# EasyEDA schematic SCH_M5 Stick DCC Interface_2022-09-24.json
TITLE: DCC Interface; REV: 5.0; Date: 2020-03-20; Sheet: 1/1; Drawn By: Hans R. Tanner; Company: IoTT - Internet of Toy Trains
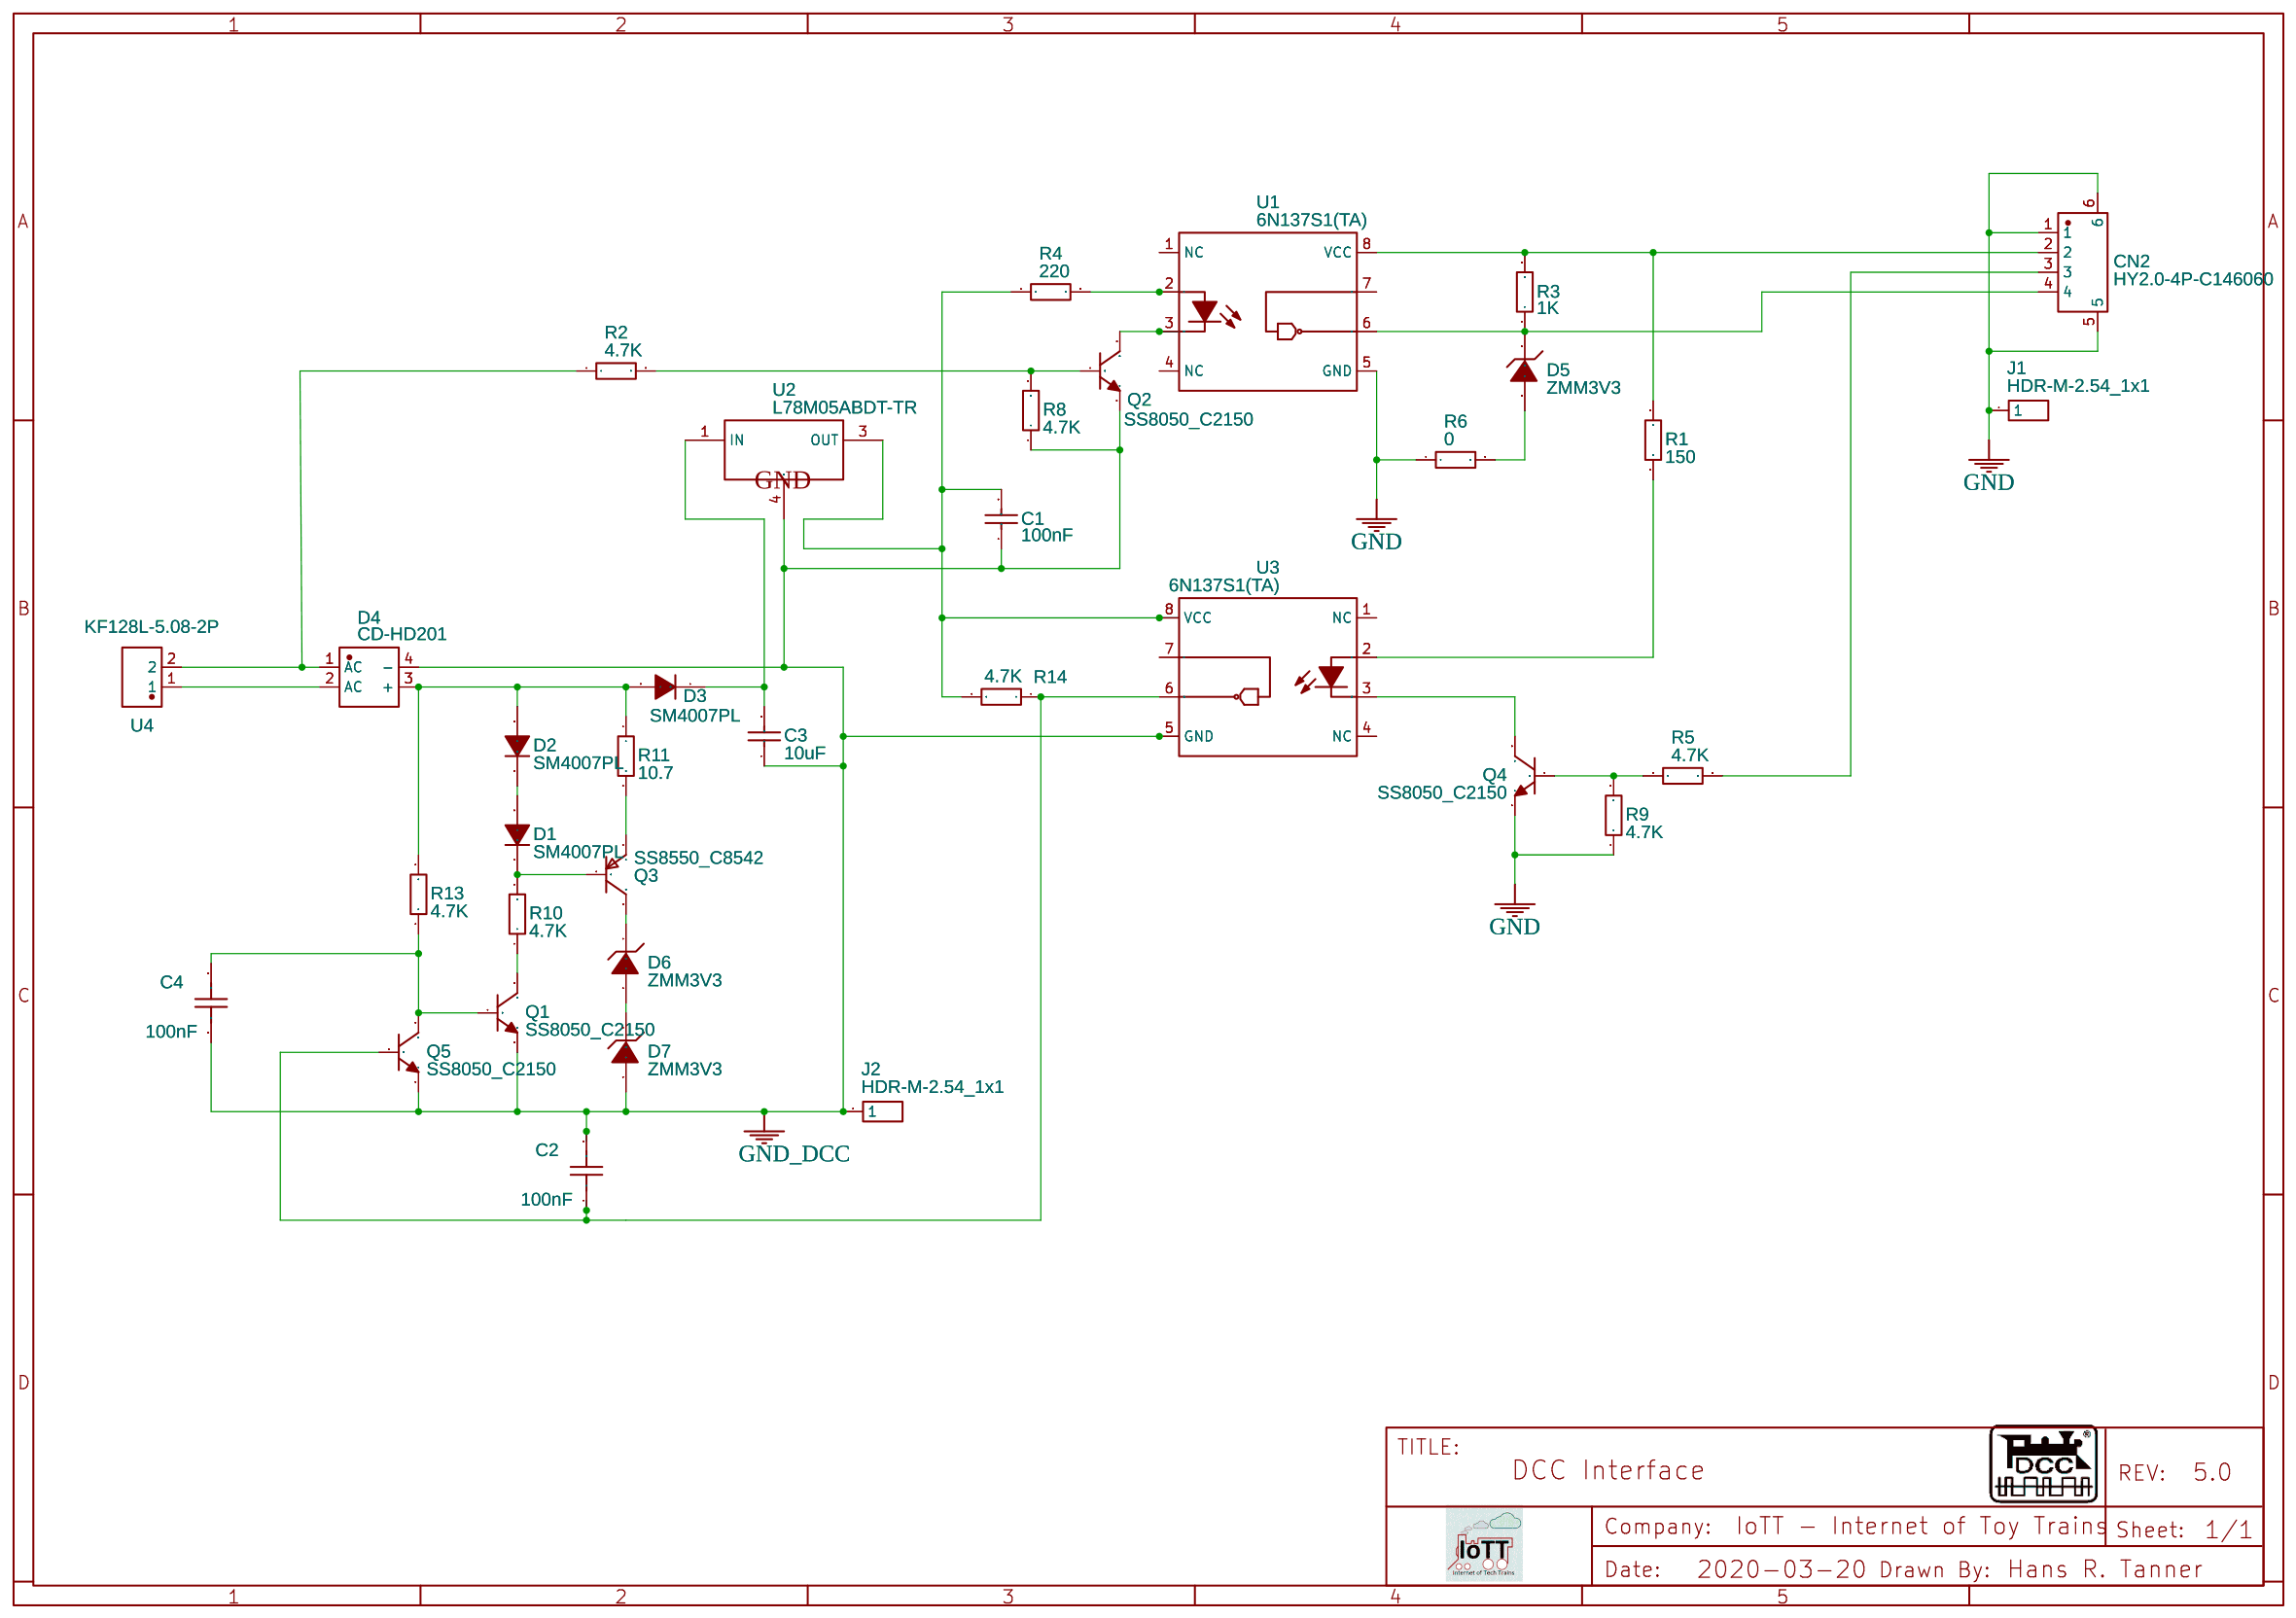
[diagram p0: schematic sheet]

## Parts
C1  100nF  [C1206]
C2  100nF  [C0603]
C3  10uF  [C0805]
C4  100nF  [C0603]
CN2  HY2.0-4P-C146060  [CONN-SMD_HY2.0-4P]
D1  SM4007PL  [SOD-123F_L2.8-W1.8-LS3.7-RD]
D2  SM4007PL  [SOD-123F_L2.8-W1.8-LS3.7-RD]
D3  SM4007PL  [SOD-123F_L2.8-W1.8-LS3.7-RD]
D4  CD-HD201  [DIO-BG-SMD_CD-HD201]
D5  ZMM3V3  [LL-34_L3.5-W1.5-RD]
D6  ZMM3V3  [LL-34_L3.5-W1.5-RD]
D7  ZMM3V3  [LL-34_L3.5-W1.5-RD]
J1  HDR-M-2.54_1x1  [HDR-M-2.54_1X1]
J2  HDR-M-2.54_1x1  [HDR-M-2.54_1X1]
Q1  SS8050_C2150  [SOT-23-3_L2.9-W1.3-P1.90-LS2.4-BR]
Q2  SS8050_C2150  [SOT-23-3_L2.9-W1.3-P1.90-LS2.4-BR]
Q3  SS8550_C8542  [SOT-23-3_L2.9-W1.3-P1.90-LS2.4-BR]
Q4  SS8050_C2150  [SOT-23-3_L2.9-W1.3-P1.90-LS2.4-BR]
Q5  SS8050_C2150  [SOT-23-3_L2.9-W1.3-P1.90-LS2.4-BR]
R1  150  [R0603]
R2  4.7K  [R0603]
R3  1K  [R0402]
R4  220  [R0603]
R5  4.7K  [R0603]
R6  0  [R0402]
R8  4.7K  [R0603]
R9  4.7K  [R0603]
R10  4.7K  [R0603]
R11  10.7  [R0603]
R13  4.7K  [R0603]
R14  4.7K  [R0603]
U1  6N137S1(TA)  [SMD-8_L9.8-W6.6-P2.54-LS10.3-BL]
U2  L78M05ABDT-TR  [TO-252-2_L6.5-W6.1-P4.58-LS10.0-BR]
U3  6N137S1(TA)  [SMD-8_L9.8-W6.6-P2.54-LS10.3-BL]
U4  KF128L-5.08-2P  [CONN-TH_P5.08_KF128L-5.08-2P]

## Library data of the parts
C1 = CL31B104KBCNNNC: Supplier: LCSC; Manufacturer: SAMSUNG; Supplier Part: C24497; SMT Type: Basic; JLCPCB SMD: Yes; LCSC Assembly: Yes; Paste Type: base
C2 C4 = CC0603KRX7R9BB104: Supplier: LCSC; Manufacturer: YAGEO; Supplier Part: C14663; JLCPCB Part Class: Basic Part
C3 = CL21A106KAYNNNE: Supplier: LCSC; Manufacturer: SAMSUNG; LCSC Assembly: Yes; Supplier Part: C15850; SMT Type: Basic
CN2 = HY2.0-4P-C146060: Supplier: LCSC; Supplier Part: C146060; Manufacturer: Boom Precision Elec; Contributor: LCSC
D1-D3 = SM4007PL: Supplier: LCSC; Manufacturer: MDD; image: //image.lceda.cn/szlcsc/C64898.jpg; Supplier Part: C64898; LCSC Assembly: Yes; SMT Type: Basic
D4 = CD-HD201: Supplier: LCSC; Supplier Part: C143782; Manufacturer: BOURNS; Contributor: LCSC; JLCPCB Part Class: Extended Part
D5-D7 = ZMM3V3: Supplier: LCSC; LCSC Assembly: Yes; Manufacturer: SEMTECH; image: //image.lceda.cn/szlcsc/C8056.jpg; Supplier Part: C8056; SMT Type: Basic
J1 J2 = HDR-M-2.54_1x1: Supplier Part: C81276; Supplier: LCSC; Contributor: LCEDA_Lib
Q1 Q2 Q4 Q5 = SS8050_C2150: Supplier: LCSC; Manufacturer: CJ; Manufacturer Part: SS8050; LCSC Assembly: Yes; image: //image.lceda.cn/szlcsc/C2150.jpg; Supplier Part: C2150; SMT Type: Basic
Q3 = SS8550_C8542: Supplier: LCSC; Manufacturer: CJ; Manufacturer Part: SS8550; LCSC Assembly: Yes; image: //image.lceda.cn/szlcsc/C8542.jpg; Supplier Part: C8542; SMT Type: Basic
R1 = 0603WAF1500T5E: Supplier: LCSC; Manufacturer: UniOhm; LCSC Assembly: Yes; Supplier Part: C22808; SMT Type: Basic
R2 R5 R10 R13 = 0603WAF4701T5E: Supplier: LCSC; Manufacturer: UniOhm; LCSC Assembly: Yes; Supplier Part: C23162; SMT Type: Basic
R3 = 0402WGF1001TCE: Supplier: LCSC; Manufacturer: UniOhm; Supplier Part: C11702; SMT Type: Basic; JLCPCB SMD: Yes; LCSC Assembly: Yes
R4 = 0603WAF1500T5E: Supplier: LCSC; Manufacturer: UniOhm; Manufacturer Part: 0603WAF2200T5E; LCSC Assembly: Yes; Supplier Part: C22962; SMT Type: Basic
R6 = 0402WGF0000TCE: Supplier: LCSC; Manufacturer: UniOhm; LCSC Assembly: Yes; Supplier Part: C17168; SMT Type: Basic
R8 R9 R14 = 0603WAF1001T5E: Supplier: LCSC; Manufacturer: UniOhm; Manufacturer Part: 0603WAF4701T5E; LCSC Assembly: Yes; Supplier Part: C23162; SMT Type: Basic
R11 = 0603WAF107JT5E: Supplier: LCSC; Manufacturer: UniOhm; Supplier Part: C22774; LCSC Assembly: Yes; SMT Type: Extend
U1 U3 = 6N137S1(TA): Supplier: LCSC; Supplier Part: C110020; Manufacturer: Everlight Elec; Contributor: LCSC; LCSC Assembly: Yes; SMT Type: Basic
U2 = L78M05ABDT-TR: Supplier: LCSC; Manufacturer: STMicroelectronics; LCSC Assembly: Yes; image: //image.lceda.cn/szlcsc/C58069.jpg; Supplier Part: C58069; SMT Type: Basic
U4 = KF128L-5.08-2P: Supplier: LCSC; Supplier Part: C474940; Manufacturer: Cixi Kefa Elec; Contributor: LCSC

## Nets
GND: CN2.1 CN2.5 CN2.6 J1.1 Q4.2(E) R6.1 R9.1 U1.5(GND)
GND_DCC: C1.1 C2.2 C3.1 C4.1 D4.4(-) D7.2(A) J2.1 Q1.2(E) Q2.2(E) Q5.2(E) R8.1 U2.4(GND) U3.5(GND)
Net-(C1-2): C1.2 R4.1 R14.2 U2.3(OUT) U3.8(VCC)
Net-(C2-1): C2.1 Q5.1(B) R14.1 U3.6(VOUT)
Net-(C3-2): C3.2 D3.1(C) U2.1(IN)
Net-(C4-2): C4.2 Q1.1(B) Q5.3(C) R13.1
Net-(CN2-2): CN2.2 R1.2 R3.2 U1.8(VCC)
Net-(CN2-3): CN2.3 R5.2
Net-(CN2-4): CN2.4 D5.1(C) R3.1 U1.6(VOUT)
Net-(D1-1): D1.1(C) Q3.1(B) R10.2
Net-(D1-2): D1.2(A) D2.1(C)
Net-(D2-2): D2.2(A) D3.2(A) D4.3(+) R11.1 R13.2
Net-(D4-1): D4.1(AC) R2.1 U4.2
Net-(D4-2): D4.2(AC) U4.1
Net-(D5-2): D5.2(A) R6.2
Net-(D6-1): D6.1(C) Q3.3(C)
Net-(D6-2): D6.2(A) D7.1(C)
Net-(Q1-3): Q1.3(C) R10.1
Net-(Q2-1): Q2.1(B) R2.2 R8.2
Net-(Q2-3): Q2.3(C) U1.3(CAT)
Net-(Q3-2): Q3.2(E) R11.2
Net-(Q4-1): Q4.1(B) R5.1 R9.2
Net-(Q4-3): Q4.3(C) U3.3(CAT)
Net-(R1-1): R1.1 U3.2(AN)
Net-(R4-2): R4.2 U1.2(AN)

Not connected (* = marked no-connect by the designer): U1 1(NC) 4(NC) 7(VE); U3 1(NC) 4(NC) 7(VE)
